# Altium schematic sheet Polarity reversal and Short circuit protection.SchDoc
size A3; SheetNumber: 7; SheetTotal: 7
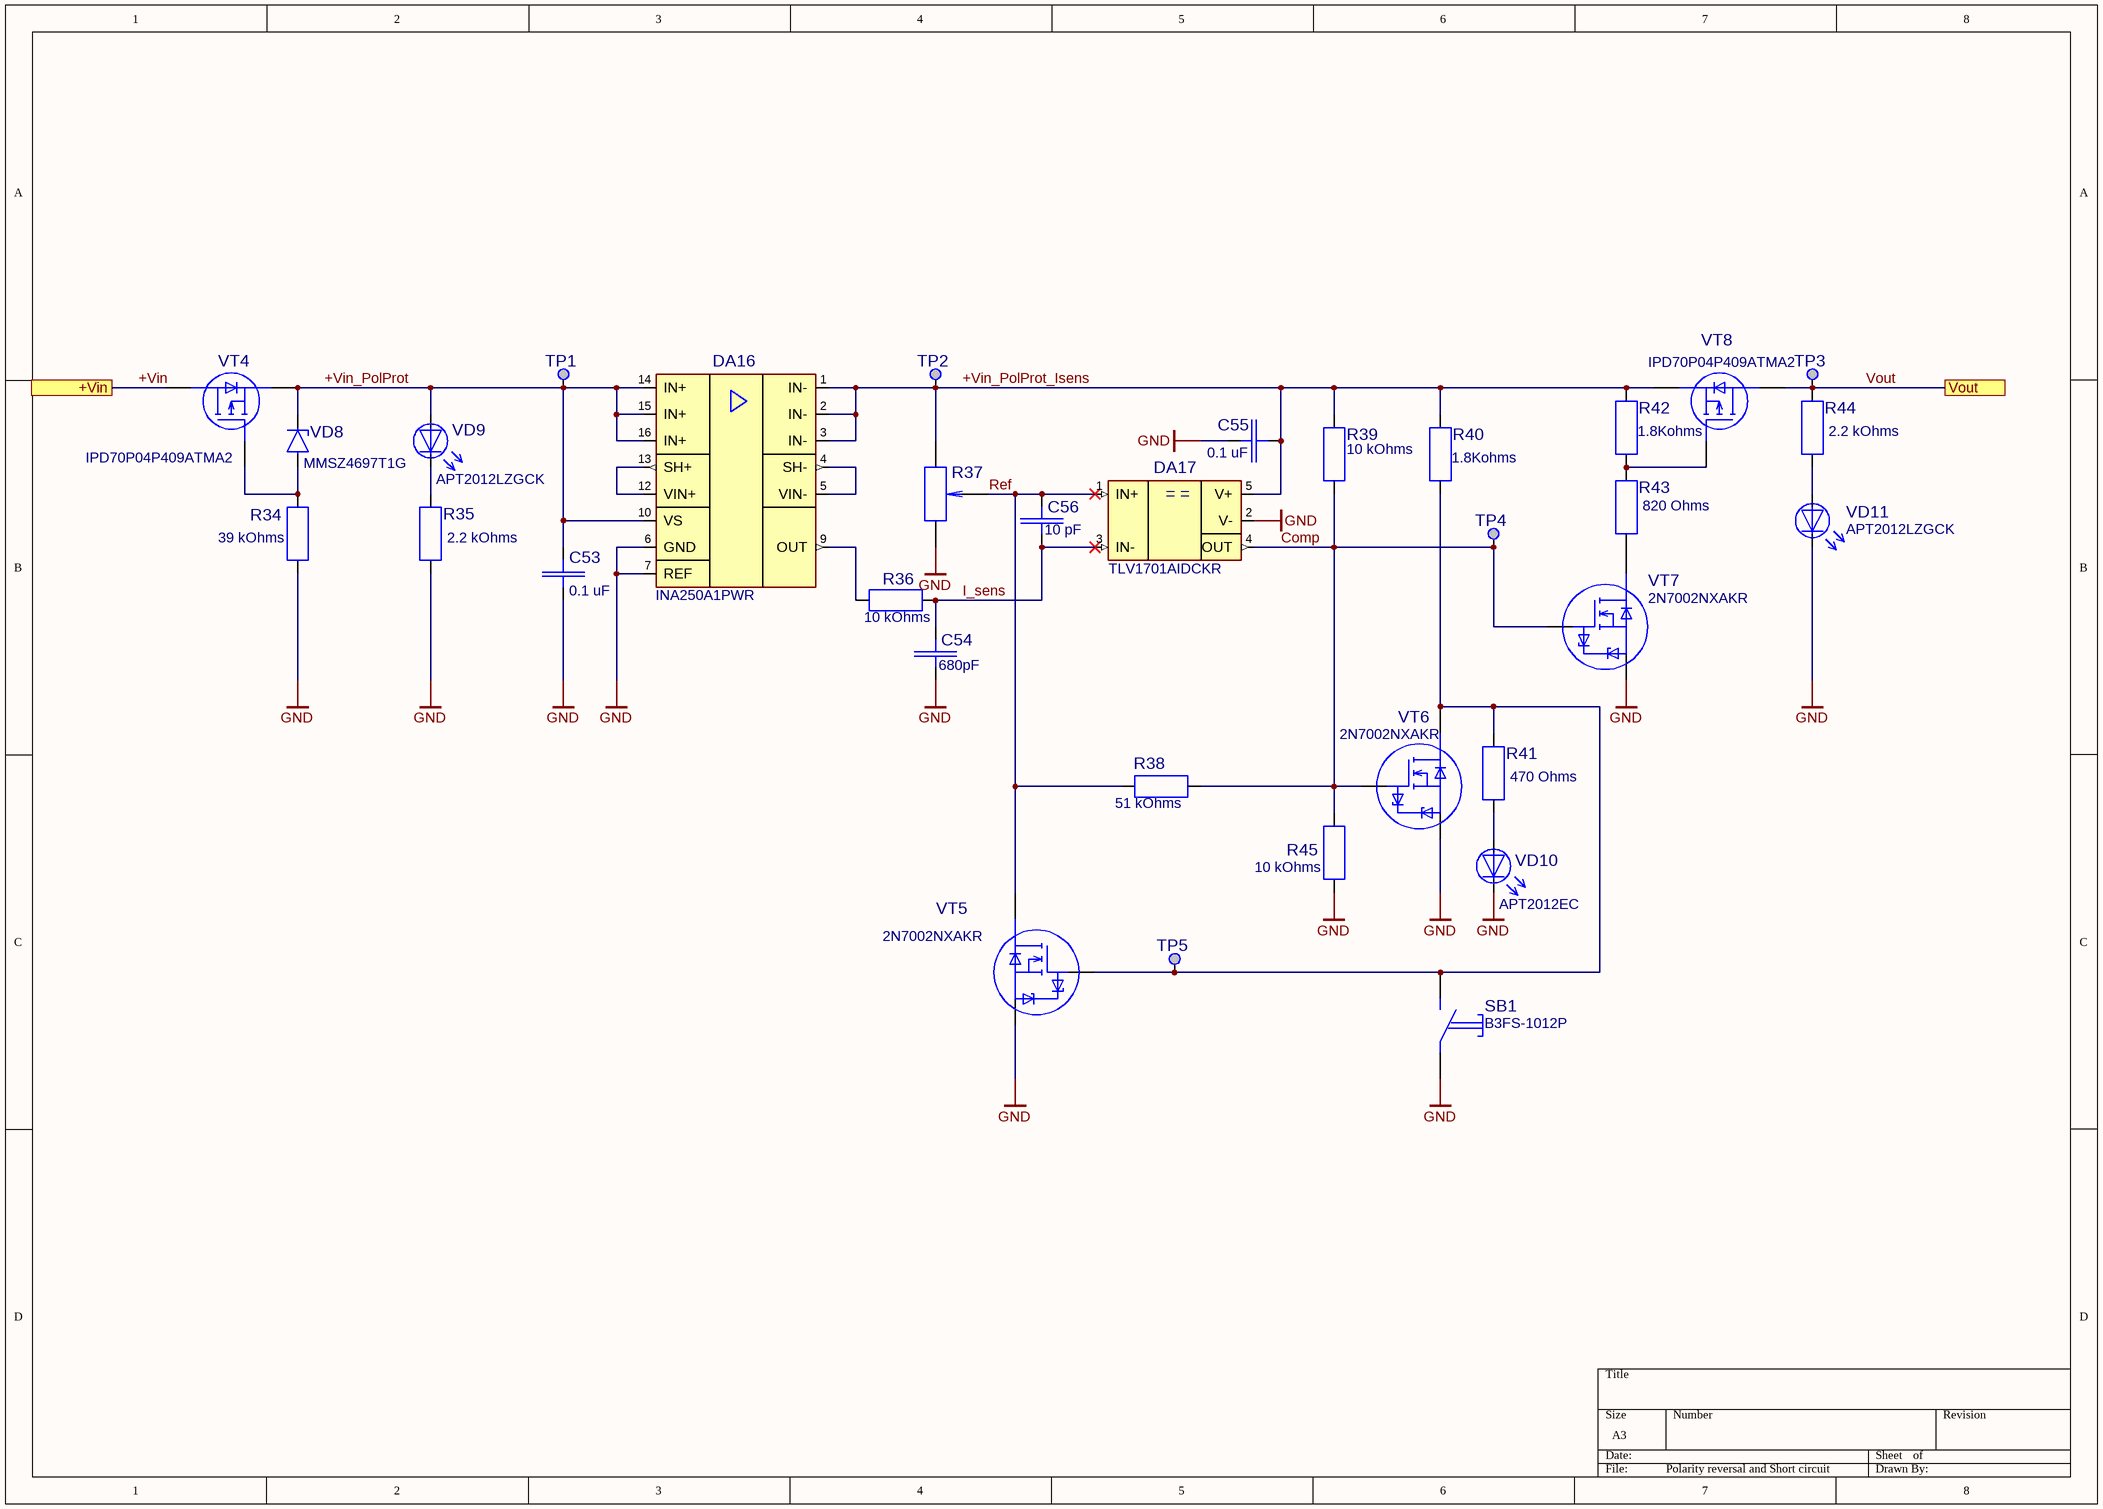
[diagram p0: Polarity reversal and Short circuit protection.SchDoc]

## Parts
C53  value 0.1 uF  [Capacitor0805_THICKNESS0.8]  (hidden comment: CL21B104KBCNNWC)
C54  value 680pF  [Capacitor0805_THICKNESS0.6]  (hidden comment: CC0805JRNPO9BN681)
C55  value 0.1 uF  [Capacitor0805_THICKNESS0.8]  (hidden comment: CL21B104KBCNNWC)
C56  value 10 pF  [Capacitor0805_THICKNESS0.6]  (hidden comment: CC0805JRNPO9BN100)
DA16  INA250A1PWR  [TSSOP-16]
DA17  TLV1701AIDCKR  [SOT-23 5pin]
R34  value 39 kOhms  [Resistor0805_THICKNESS0.6]  (hidden comment: RE0805FRE0739KL)
R35  value 2.2 kOhms  [Resistor0805_THICKNESS0.6]  (hidden comment: RC0805FR-132K2L)
R36  value 10 kOhms  [Resistor0805_THICKNESS0.6]  (hidden comment: RC0805FR-0710KL)
R37  PVG5A203C03R00  [PVG5A]  (value not drawn)
R38  value 51 kOhms  [Resistor0805_THICKNESS0.6]  (hidden comment: RC0805FR-0751KL)
R39  value 10 kOhms  [Resistor0805_THICKNESS0.6]  (hidden comment: RC0805FR-0710KL)
R40  value 1.8Kohms  [RCS0805 e3]  (hidden comment: RCS08051K80FKEA)
R41  value 470 Ohms  [Resistor0805_THICKNESS0.6]  (hidden comment: RC0805FR-13470RL)
R42  value 1.8Kohms  [RCS0805 e3]  (hidden comment: RCS08051K80FKEA)
R43  value 820 Ohms  [Resistor0805_THICKNESS0.6]  (hidden comment: RC0805FR-07820RL)
R44  value 2.2 kOhms  [Resistor0805_THICKNESS0.6]  (hidden comment: RC0805FR-132K2L)
R45  value 10 kOhms  [Resistor0805_THICKNESS0.6]  (hidden comment: RC0805FR-0710KL)
SB1  B3FS-1012P  [Flat Switches]
TP1  test point  [test point]  (value not drawn)
TP2  test point  [test point]  (value not drawn)
TP3  test point  [test point]  (value not drawn)
TP4  test point  [test point]  (value not drawn)
TP5  test point  [test point]  (value not drawn)
VD8  MMSZ4697T1G  [SOD-123-2]
VD9  APT2012LZGCK  [APT2012LZGCK0805_LEDs]
VD10  APT2012EC  [APT2012LZGCK0805_LEDs]
VD11  APT2012LZGCK  [APT2012LZGCK0805_LEDs]
VT4  IPD70P04P409ATMA2  [TO-252-3]
VT5  2N7002NXAKR  [SOT-23-3]
VT6  2N7002NXAKR  [SOT-23-3]
VT7  2N7002NXAKR  [SOT-23-3]
VT8  IPD70P04P409ATMA2  [TO-252-3]

## Ports
+Vin (see NGI_Search2[1B]), Vout (see NGI_Search2[2B])

## Nets
GND: C53.1 C54.1 C55.1 DA16.6(GND) DA16.7(REF) DA17.2(V-) R34.1 R35.1 R37.1 R45.1 SB1.1 VD10.C VD11.C VT5.2(S) VT6.2(S) VT7.2(S)
+Vin: VT4.2(D) ; port +Vin
+Vin_PolProt: C53.2 DA16.10(VS) DA16.14(IN+) DA16.15(IN+) DA16.16(IN+) TP1.1 VD8.1(C) VD9.A VT4.3(S)
+Vin_PolProt_Isens: C55.2 DA16.1(IN-) DA16.2(IN-) DA16.3(IN-) DA17.5(V+) R37.3 R39.2 R40.2 R42.2 TP2.1 VT8.3(S)
Comp: DA17.4(OUT) R38.2 R39.1 R45.2 TP4.1 VT6.1(G) VT7.1(G)
I_sens: C54.2 C56.1 DA17.3(IN-) R36.2
Ref: C56.2 DA17.1(IN+) R37.2 R38.1 VT5.3(D)
Vout: R44.2 TP3.1 VT8.2(D) ; port Vout
NetDA16_4: DA16.4(SH-) DA16.5(VIN-)
NetDA16_9: DA16.9(OUT) R36.1
NetDA16_12: DA16.12(VIN+) DA16.13(SH+)
NetR34_2: R34.2 VD8.2(A) VT4.1(G)
NetR35_2: R35.2 VD9.C
NetR40_1: R40.1 R41.2 SB1.3 TP5.1 VT5.1(G) VT6.3(D)
NetR41_1: R41.1 VD10.A
NetR42_1: R42.1 R43.2 VT8.1(G)
NetR43_1: R43.1 VT7.3(D)
NetR44_1: R44.1 VD11.A

Not connected (* = marked no-connect by the designer): DA16 8(GND) 11(GND); SB1 2 4

## Notes on the sheet
- (in symbol TLV1701AIDCKR) ㅤ= =

## Library data of the parts
C53 C55 = CL21B104KBCNNWC: Multilayer Ceramic Capacitors MLCC - SMD/SMT 100nF+/-10% 50V X7R 0805; Manufacturer: Samsung Electro-Mechanics; Tolerance: 10%; Dielectric: X7R; ManufacturerPartNumber: CL21B104KBCNNWC; Mouser Price/Stock: https://eu.mouser.com/ProductDetail/Samsung-Electro-Mechanics/CL21B104KBCNNWC?qs=yOVawPpwOwlu2UTVxWhmlw%3D%3D; Power/Voltage: 50V; Case: 0805; Datasheet Link: https://eu.mouser.com/datasheet/2/585/MLCC-1837944.pdf; Mouser Part Number: 187-CL21B104KBCNNWC
C54 = CC0805JRNPO9BN681: Multilayer Ceramic Capacitors MLCC - SMD/SMT 50 V 680pF C0G 0805 5%; Manufacturer: YAGEO; Dielectric: C0G (NP0); Power/Voltage: 50V; Case: 0805; Datasheet Link: https://eu.mouser.com/datasheet/2/447/UPY_GP_NP0_16V_to_50V_18-1730511.pdf; ManufacturerPartNumber: CC0805JRNPO9BN681; Mouser Part Number: 603-CC805JRNPO9BN681; Mouser Price/Stock: https://eu.mouser.com/ProductDetail/YAGEO/CC0805JRNPO9BN681?qs=AgBp2OyFlx9ovATSZcyCAw%3D%3D; Tolerance: 5%
C56 = CC0805JRNPO9BN100: Multilayer Ceramic Capacitors MLCC - SMD/SMT 50 V 10 pF C0G 0805 5%; Manufacturer: YAGEO; Dielectric: C0G (NP0); Power/Voltage: 50V; Case: 0805; Datasheet Link: https://eu.mouser.com/datasheet/2/447/UPY_GP_NP0_16V_to_50V_18-1730511.pdf; ManufacturerPartNumber: CC0805JRNPO9BN100; Mouser Part Number: 603-CC805JRNPO9BN100; Mouser Price/Stock: https://eu.mouser.com/ProductDetail/YAGEO/CC0805JRNPO9BN100?qs=DBlb8Oi07mYgwCvOiwRYAw%3D%3D; Tolerance: 5%
DA16 = INA250A1PWR: Current & Power Monitors & Regulators 36V, bi-directional, precision current sense amplifier w/int. shunt resistor 16-TSSOP -40 to 125; Manufacturer: Texas Instruments; Case: TSSOP-16; Datasheet Link: https://www.ti.com/lit/ds/symlink/ina250.pdf?ts=1706467287893&ref_url=https%253A%252F%252Feu.mouser.com%252F; ManufacturerPartNumber: INA250A1PWR; Mouser Part Number: 595-INA250A1PWR; Mouser Price/Stock: https://eu.mouser.com/ProductDetail/Texas-Instruments/INA250A1PWR?qs=dHDuPHwQO790CDZpmrjjbA%3D%3D
DA17 = TLV1701AIDCKR: Analog Comparators 2.2-V to 36-V, micro Power Comparator; Manufacturer: Texas Instruments; Case: SOT-23 5pin; Datasheet Link: https://www.ti.com/lit/ds/symlink/tlv1702.pdf?ts=1706525533181&ref_url=https%253A%252F%252Feu.mouser.com%252F; ManufacturerPartNumber: TLV1701AIDCKR; Mouser Part Number: TLV1701AIDCKR; Mouser Price/Stock: https://eu.mouser.com/ProductDetail/Texas-Instruments/TLV1701AIDCKR?qs=n7vHx8wJlDHoumX0KH24OA%3D%3D
R34 = RE0805FRE0739KL: Thick Film Resistors 39 kOhms 125 mW 0805 1%; Manufacturer: YAGEO; Power/Voltage: 125 mW / 150V; Case: 0805; Datasheet Link: https://eu.mouser.com/datasheet/2/447/PYu_RE_105_RoHS_L_6-3003059.pdf; ManufacturerPartNumber: RE0805FRE0739KL; Mouser Part Number: 603-RE0805FRE0739KL; Mouser Price/Stock: https://eu.mouser.com/ProductDetail/YAGEO/RE0805FRE0739KL?qs=sGAEpiMZZMvdGkrng054t8Pyfa06IR6dA9gJB6K12e1zjPrdMTPWEg%3D%3D; Tolerance: 1%
R35 R44 = RC0805FR-132K2L: Thick Film Resistors 2.2 kOhms 250 mW 0805 1%; Manufacturer: YAGEO; Power/Voltage: 250 mW / 150V; Case: 0805; Datasheet Link: https://eu.mouser.com/datasheet/2/447/YAGEO_PYu_RC_Group_51_RoHS_L_12-3313492.pdf; ManufacturerPartNumber: RC0805FR-132K2L; Mouser Part Number: 603-RC0805FR-132K2L; Mouser Price/Stock: https://eu.mouser.com/ProductDetail/YAGEO/RC0805FR-132K2L?qs=sGAEpiMZZMvdGkrng054t8AJgcdMkx7x7aXSywnMiOE%3D; Tolerance: 1%
R36 R39 R45 = RC0805FR-0710KL: Thick Film Resistors 10 kOhms 125 mW 0805 1%; Manufacturer: YAGEO; Power/Voltage: 125 mW / 150V; Case: 0805; Datasheet Link: https://eu.mouser.com/datasheet/2/447/YAGEO_PYu_RC_Group_51_RoHS_L_12-3313492.pdf; ManufacturerPartNumber: RC0805FR-0710KL; Mouser Part Number: 603-RC0805FR-0710KL; Mouser Price/Stock: https://eu.mouser.com/ProductDetail/YAGEO/RC0805FR-0710KL?qs=sGAEpiMZZMvdGkrng054txdMlaQGj9fi4uZGpN02qIo%3D; Tolerance: 1%
R37 = PVG5A203C03R00: Trimmer Resistors - SMD 20Kohms 5mm 11turn Top Adjust; Manufacturer: Bourns; Designator: R; Power/Voltage: 250 mW; Tolerance: 10%; Case: PVG5A; Datasheet Link: https://eu.mouser.com/datasheet/2/54/pvg5-907351.pdf; ManufacturerPartNumber: PVG5A203C03R00; Mouser Part Number: 81-PVG5A203C03R00; Mouser Price/Stock: https://eu.mouser.com/ProductDetail/Bourns/PVG5A203C03R00?qs=K6aI6PsrKE0LOWormtvBdw%3D%3D; Value: 20Kohms
R38 = RC0805FR-0751KL: Thick Film Resistors 51 kOhms 125 mW 0805 1%; Manufacturer: YAGEO; Power/Voltage: 125 mW / 150V; Case: 0805; Datasheet Link: https://eu.mouser.com/datasheet/2/447/YAGEO_PYu_RC_Group_51_RoHS_L_12-3313492.pdf; ManufacturerPartNumber: RC0805FR-0751KL; Mouser Part Number: 603-RC0805FR-0751KL; Mouser Price/Stock: https://eu.mouser.com/ProductDetail/YAGEO/RC0805FR-0751KL?qs=sGAEpiMZZMvdGkrng054t8AJgcdMkx7x7tQBjPKHhxY%3D; Tolerance: 1%
R40 R42 = RCS08051K80FKEA: Thick Film Resistors 500mW 1.8Kohms 1% 100ppm AEC-Q200; Manufacturer: Vishay; Power/Voltage: 500 mW / 150V; Case: 0805; Datasheet Link: https://www.vishay.com/docs/20065/rcse3.pdf; ManufacturerPartNumber: RCS08051K80FKEA; Mouser Part Number: 71-RCS08051K80FKEA; Mouser Price/Stock: https://eu.mouser.com/ProductDetail/Vishay-Dale/RCS08051K80FKEA?qs=sGAEpiMZZMvdGkrng054t556eu%2FvOimDPinpy0KfWNKlrcvC2gOqHQ%3D%3D; Tolerance: 1%
R41 = RC0805FR-13470RL: Thick Film Resistors 470Ohms 1/8W 0805 1%; Manufacturer: YAGEO; Power/Voltage: 125 mW / 150V; Case: 0805; Datasheet Link: https://eu.mouser.com/datasheet/2/447/PYu_RC_Group_51_RoHS_L_11-1984063.pdf; ManufacturerPartNumber: RC0805FR-13470RL; Mouser Part Number: 603-RC0805FR-13470RL; Mouser Price/Stock: https://eu.mouser.com/ProductDetail/YAGEO/RC0805FR-13470RL?qs=sGAEpiMZZMvdGkrng054t8AJgcdMkx7xT%252BvX9TIwRXU%3D; Tolerance: 1%
R43 = RC0805FR-07820RL: Thick Film Resistors 820 Ohms 125 mW 0805 1%; Manufacturer: YAGEO; Power/Voltage: 125 mW / 150V; Case: 0805; Datasheet Link: https://eu.mouser.com/datasheet/2/447/YAGEO_PYu_RC_Group_51_RoHS_L_12-3313492.pdf; ManufacturerPartNumber: RC0805FR-07820RL; Mouser Part Number: 603-RC0805FR-07820RL; Mouser Price/Stock: https://eu.mouser.com/ProductDetail/YAGEO/RC0805FR-07820RL?qs=sGAEpiMZZMvdGkrng054t8Tx25L%252BvTaRw7u%2FIxz%252Bh2w%3D; Tolerance: 1%
SB1 = B3FS-1012P: Tactile Switches Tactile Switch; Manufacturer: Omron; Case: Flat; Datasheet Link: https://eu.mouser.com/datasheet/2/307/omron_B3FS-1189765.pdf; ManufacturerPartNumber: B3FS-1012P; Mouser Part Number: 653-B3FS-1012P; Mouser Price/Stock: https://eu.mouser.com/ProductDetail/Omron-Electronics/B3FS-1012P?qs=1tDaWCEHQQ7mwfTJVAKWQA%3D%3D
VD8 = MMSZ4697T1G: Zener Diodes 10V 500mW; Manufacturer: onsemi; Case: SOD-123-2; Datasheet Link: https://eu.mouser.com/datasheet/2/308/1/MMSZ4678T1_D-2316153.pdf; ManufacturerPartNumber: MMSZ4697T1G; Mouser Part Number: 863-MMSZ4697T1G; Mouser Price/Stock: https://eu.mouser.com/ProductDetail/onsemi/MMSZ4697T1G?qs=P4IOph%252Bbot8MYBlZDJ3TeA%3D%3D
VD9 VD11 = APT2012LZGCK: Standard LEDs - SMD 2.0X1.2MM LOW CRNT; Manufacturer: Kingbright; Case: 0805; ManufacturerPartNumber: APT2012LZGCK; Mouser Part Number: 604-APT2012LZGCK; Mouser Price/Stock: https://eu.mouser.com/ProductDetail/Kingbright/APT2012LZGCK?qs=6oMev5NRZMHOosFiXb%2F3qw%3D%3D; Datasheet Link: https://eu.mouser.com/datasheet/2/216/APT2012LZGCK-535687.pdf
VD10 = APT2012EC: Standard LEDs - SMD HI EFF RED WTR CLR; Manufacturer: Kingbright; Case: 0805; Datasheet Link: https://eu.mouser.com/datasheet/2/216/APT2012EC-35230.pdf; ManufacturerPartNumber: APT2012EC; Mouser Part Number: 604-APT2012EC; Mouser Price/Stock: https://eu.mouser.com/ProductDetail/Kingbright/APT2012EC?qs=sGAEpiMZZMvyj6n1w4pZD5QO%2FJ%252BHmnjZ4Dr1%252BP7JiL4%3D
VT4 VT8 = IPD70P04P409ATMA2: MOSFET (20V 40V); Manufacturer: Infineon; Case: TO-252 3pin; Datasheet Link: https://eu.mouser.com/datasheet/2/196/Infineon_IPD70P04P4_09_DS_v01_00_en-1730695.pdf; ManufacturerPartNumber: IPD70P04P409ATMA2; Mouser Part Number: IPD70P04P409ATMA2; Mouser Price/Stock: https://eu.mouser.com/ProductDetail/Infineon-Technologies/IPD70P04P409ATMA2?qs=GBLSl2Akiru5vq%252BvDEUdzg%3D%3D
VT5-VT7 = 2N7002NXAKR: MOSFET 2N7002NXAK/SOT23/TO-236AB; Manufacturer: Nexperia; Case: SOT-23 3pin; Datasheet Link: https://eu.mouser.com/datasheet/2/916/2N7002NXAK-1623722.pdf; ManufacturerPartNumber: 2N7002NXAKR; Mouser Part Number: 771-2N7002NXAKR; Mouser Price/Stock: https://eu.mouser.com/ProductDetail/Nexperia/2N7002NXAKR?qs=%252B6g0mu59x7JoAsZYPFXqhw%3D%3D